# EasyEDA Pro project ProProject_Xtal_LO_Ver0.1_2023-07-24.epro

# Schematic Schematic1
Create Date: 2023-07-24; Page Name: P1; Project Name: Xtal_LO_Ver0.1; Schematic Name: Schematic1; Update Date: 2023-07-24; Company: 嘉立创EDA; Page Size: A5; Version: V1.0
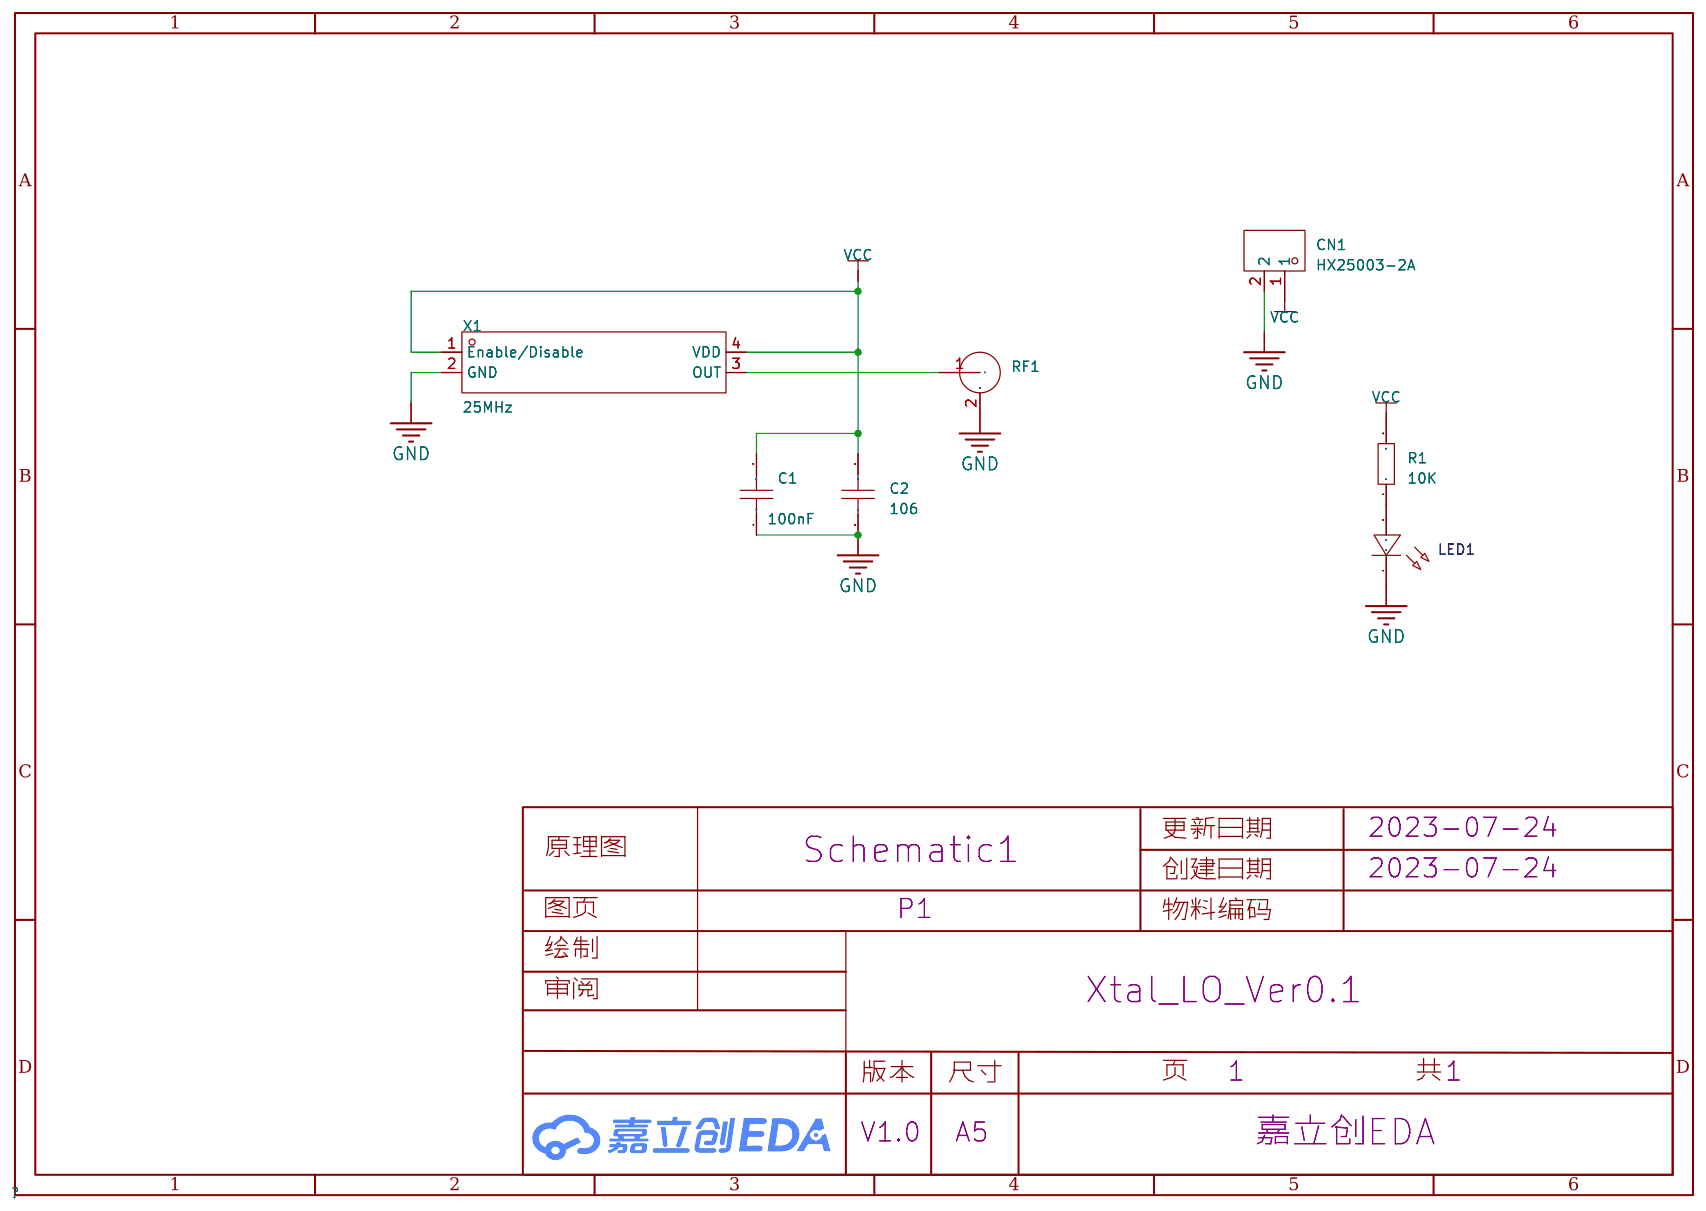
[diagram p0: schematic sheet]

## Parts
C1  100nF  [C0603]
C2  106  [C1206]
CN1  HX25003-2A  [CONN-TH_2P-P2.50_HX25003-2A]
LED1  -  [LED_0805]
R1  10K  [R0603]
RF1  -  [SMA-SMD_BWSMA-KE-P001]
X1  25MHz  [OSC-SMD_4P-L3.2-W2.5-BL]

## Library data of the parts
C1 = CAP_0603: Supplier Footprint: 0603
C2 = CAP_1206: Supplier Footprint: 1206
CN1 = HX25003-2A: 参考系列:XH;间距:2.5mm;插针结构:1x2P;排数:1;每排PIN数:2;行距:-;公母:公型插针;安装方式:直插;额定电流:-;工作温度范围:-;; LCSC Part Name: XH 2.5mm 1x2P 直插 母座; Supplier Part: C442299; Manufacturer: HX(红星); Supplier Footprint: 插件,P=2.5mm; JLCPCB Part Class: Extended Part; Datasheet: https://atta.szlcsc.com/upload/public/pdf/source/20191028/C442299_791AF061D32404B3CF2743C2F942DF66.pdf; Supplier: LCSC; Reference Series: XH; Pitch: 2.5mm; Pins Structure: 1x2P; Number of Rows: 1; Number of PINs Per Row: 2; Gender: 公型插针; Mounting Style: 直插
LED1 = LED_0805-G: Supplier Footprint: 0805
R1 = Res_0603: Supplier Footprint: 0603
RF1 = SMA: 连接器类型:板端;射频系列:SMA;接口类型:内孔;端口数量:1;阻抗:-;频率-最大值:-;样式:偏脚;接口直径:5.2mm;接口长度/高度:-;工作温度范围:-;; LCSC Part Name: SMA内孔偏脚; Supplier Part: C496550; Manufacturer: BATWIRELESS(蝙蝠无线); Manufacturer Part: BWSMA-KE-P001; Supplier Footprint: 插件; JLCPCB Part Class: ExtendedPart; Datasheet: https://atta.szlcsc.com/upload/public/pdf/source/20200416/C496550_06668BF2E3B968EA39F96D17E7156373.pdf; Supplier: LCSC; Connector Type: 板端; Interface Type: 内孔; Number of Ports: 1; Style: 偏脚; Interface Diameter: 5.2mm
X1 = OT322525MJBA4SL: 频率:25MHz;频率稳定度:±10ppm;工作电压:1.8V~3.3V;; LCSC Part Name: 25MHz ±10ppm 1.8V~3.3V YSO110TR; Supplier Part: C669088; Manufacturer: YXC(扬兴晶振); Supplier Footprint: SMD3225-4P; JLCPCB Part Class: 扩展库; Datasheet: https://atta.szlcsc.com/upload/public/pdf/source/20210329/C669065_30B18CFE780D377BA4E84F6ED1951959.pdf; Supplier: LCSC; Frequency Stability: ±10ppm; Supply Voltage: 1.8V~3.3V; Supply Current (Max): 5mA; Operating Temperature: -40℃~+85℃

## Nets
GND: C1.1 C2.1 CN1.2 LED1.1(C) RF1.2 X1.2(GND)
VCC: C1.2 C2.2 CN1.1 R1.2 X1.1(Enable/Disable) X1.4(VDD)
Net-(LED1-2): LED1.2(A) R1.1
Net-(RF1-1): RF1.1 X1.3(OUT)

# Board PCB1
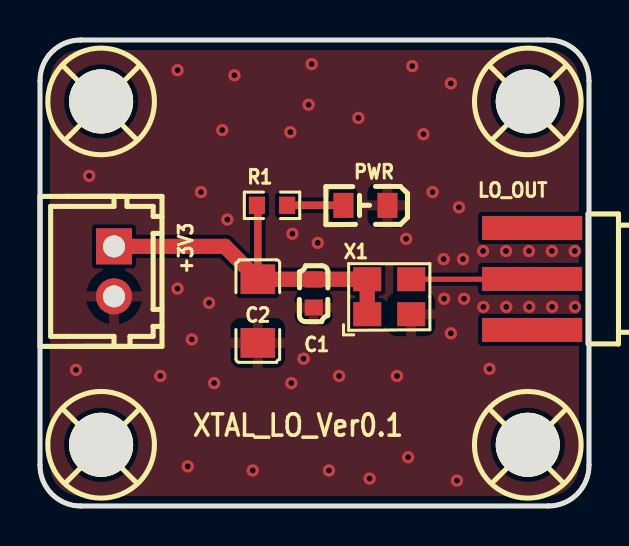
[diagram p1: board, top side]
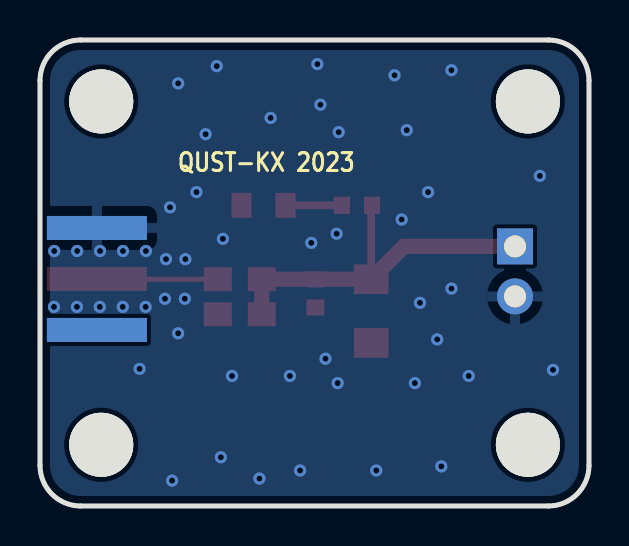
[diagram p2: board, bottom side, seen from below]

Outline 27.45 x 23.3 mm; copper layers: Top Layer, Inner3, Inner4, Inner5, Inner6, Inner7, Inner8, Inner9, Inner10, Inner11, Inner12, Inner13, Inner14, Inner15, Inner16, Inner17, Inner18, Inner19, Inner20, Inner21, Inner22, Inner23, Inner24, Inner25, Inner26, Inner27, Inner28, Inner29, Inner30, Bottom Layer. Coordinates in mm from the lower left corner of the outline.
Outline path: 0,21.27 0,2.03 arc(0.6,0.6) 2.03,0 25.42,0 arc(26.86,0.6) 27.45,2.03 27.45,21.27 arc(26.86,22.71) 25.42,23.3 2.03,23.3 arc(0.6,22.71) 0,21.27
Stack: Top Layer 0.035mm / Dielectric1 1.51mm FR4 er 4.5 / Bottom Layer 0.035mm

## Design rules (mm)
template: JLCPCB Capability(Two Layers Board)
spacing copperThickness1oz (default): track to track 0.102, other pairs 0.152 to 0.3
spacing copperThickness2oz: track to track 0.203, other pairs 0.152 to 0.3
track width copperThickness1oz (default): min 0.127, default 0.254, max 2.54
track width copperThickness2oz: min 0.203, default 0.254, max 2.54
differential pair differentialPair (default): width min 0.127, default 0.254, max 2.54; gap min 0.152, default 0.152
via viaSize (default): diameter min 0.5, default 0.61, max 10; hole min 0.3, default 0.305, max 6.3

## Placement (name value [footprint] x y rotation side)
+3V3  HX25003-2A  [CONN-TH_2P-P2.50_HX25003-2A]  3.7 11.73 270 top
C1  100nF  [C0603]  13.69 10.62 90 top
C2  106  [C1206]  10.89 9.75 90 top
LO_OUT  -  [SMA-SMD_BWSMA-KE-P001]  24.61 11.35 0 top
PWR  -  [LED_0805]  16.23 15.04 180 top
R1  10K  [R0603]  11.6 15.04 180 top
TP1  -  [M3螺丝]  3.12 20.17 0 top
TP2  -  [M3螺丝]  24.46 20.17 0 top
TP3  -  [M3螺丝]  3.12 3 0 top
TP4  -  [M3螺丝]  24.46 3 0 top
U1  -  [客编]  0.94 11.94 90 top
X1  25MHz  [OSC-SMD_4P-L3.2-W2.5-BL]  17.46 10.47 0 top

## Footprints (pads in the part's own frame, mm; a bottom-side part is the same pattern mirrored in y, then rotated)
C0603
  rect 0.8x0.9 smd: 1(-0.7,0) 2(0.7,0)
C1206
  rect 1.485x1.728 smd: 1(-1.593,0) 2(1.593,0)
CONN-TH_2P-P2.50_HX25003-2A
  rect 1.8x1.8 hole 1.1: 1(-1.25,0)
  round 1.8 hole 1.1: 2(1.25,0)
LED_0805
  rect 1x1.25 smd: 1(-1.15,0.005) 2(1.05,0.005)
M3螺丝
  round 3.2 hole 3.2: 1(-0.064,0.064)
OSC-SMD_4P-L3.2-W2.5-BL
  rect 1.4x1.2 smd: 1(-1.1,-0.875) 2(1.1,-0.875) 3(1.1,0.875) 4(-1.1,0.875)
R0603
  rect 0.806x0.864 smd: 1(-0.753,0) 2(0.753,0)
SMA-SMD_BWSMA-KE-P001
  rect 5x1.2 smd: 1(0,0) 2(0,2.55) 2(0,-2.55)
  rect 5x1.2 smd far side: 2(0,2.55) 2(0,-2.55)

## Nets
GND: +3V3.2 C1.1 C2.1 LO_OUT.2 PWR.1 X1.2
VCC: +3V3.1 C1.2 C2.2 R1.2 X1.1 X1.4
$1N251: LO_OUT.1 X1.3
$1N733: PWR.2 R1.1

Pads without a net: TP1 1; TP2 1; TP3 1; TP4 1

## Via types
v1: diameter 0.61, hole 0.305, Top Layer to Bottom Layer, 50 vias

## Routing (per net, layer and track width the routed paths; a pad name or vN(x,y) marks a point on that pad's centre or on a via; arc(x,y) is an arc through that point)
GND:
  vias: v1(1.8,6.81) v1(2.46,16.51) v1(6.02,6.5) v1(6.88,21.79) v1(6.88,10.87) v1(7.39,1.98) v1(7.59,8.33) v1(8.05,15.7) v1(8.45,10.16) v1(8.71,6.15) v1(9.11,18.8) v1(9.37,14.33) v1(9.72,21.54) v1(10.64,1.78) v1(12.52,18.69) v1(12.57,6.15) v1(12.62,13.61) v1(13.18,7.37) v1(13.43,20.07) v1(13.58,22.1) v1(13.89,13.16) v1(14.45,1.78) v1(14.96,6.5) v1(15.92,19.41) v1(16.48,1.37) v1(17.85,6.5) v1(18.31,13.36) v1(18.41,2.44) v1(18.61,22) v1(19.17,18.59) v1(19.63,15.7) v1(20.18,12.34) v1(20.21,10.36) v1(20.54,21.13) v1(20.54,8.64) v1(20.85,1.27) v1(20.95,14.94) v1(21.15,12.34) v1(21.2,10.36) v1(22.16,12.75) v1(22.17,9.96) v1(22.47,6.86) v1(23.3,12.75) v1(23.32,9.96) v1(24.45,12.75) v1(24.46,9.96) v1(25.59,12.75) v1(25.61,9.96) v1(26.74,12.75) v1(26.75,9.96)
VCC: length 18.8
  Top Layer w0.381: R1.2 10.89,15 C2.2
  Top Layer w0.762: 13.7,11.34 X1.4 X1.1 ; 13.7,11.34 C1.2 ; 13.7,11.34 C2.2 9.25,12.98 +3V3.1
$1N251: length 6.1
  Top Layer w0.254: LO_OUT.1 24.59,11.34 X1.3
$1N733: length 2.8
  Top Layer w0.381: R1.1 15.17,15.04 15.18,15.03

## Copper pours and planes (outline as drawn; the poured copper is in the pictures)
GND on Top Layer: 0,23.3 27.45,23.3 27.45,-0.05 0,-0.05
GND on Bottom Layer: 0,23.3 27.45,23.3 27.45,-0.05 0,-0.05

## Text on the board
Bottom Silkscreen Layer: QUST-KX 2023
Top Silkscreen Layer: XTAL_LO_Ver0.1
